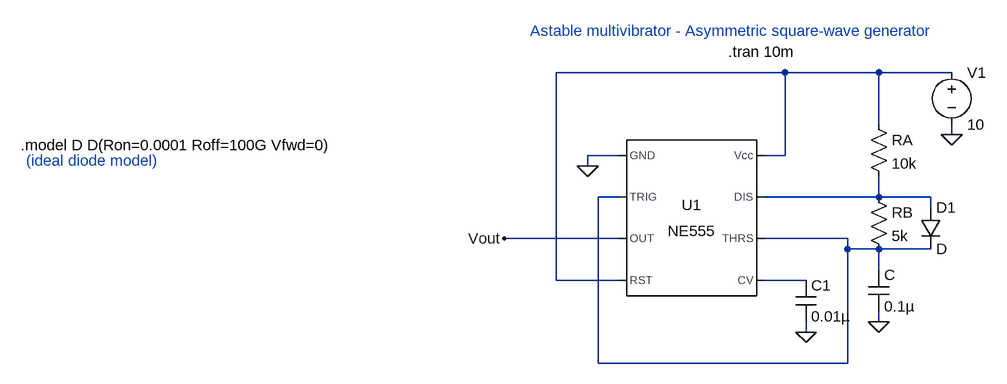
[diagram p0: schematic asymm-gen.asc]
asymm-gen.asc, the LTspice schematic file:
Version 4
SHEET 1 880 680
WIRE 368 -48 16 -48
WIRE 512 -48 368 -48
WIRE 624 -48 512 -48
WIRE 512 32 512 -48
WIRE 624 48 624 32
WIRE 112 80 64 80
WIRE 368 80 368 -48
WIRE 368 80 336 80
WIRE 64 96 64 80
WIRE 112 144 80 144
WIRE 512 144 512 112
WIRE 512 144 336 144
WIRE 592 144 512 144
WIRE 592 160 592 144
WIRE 112 208 -64 208
WIRE 464 208 336 208
WIRE 464 224 464 208
WIRE 512 224 464 224
WIRE 592 224 512 224
WIRE 512 256 512 224
WIRE 16 272 16 -48
WIRE 112 272 16 272
WIRE 400 272 336 272
WIRE 512 336 512 320
WIRE 400 352 400 336
WIRE 80 400 80 144
WIRE 464 400 464 224
WIRE 464 400 80 400
FLAG 64 96 0
FLAG 624 48 0
FLAG 400 352 0
FLAG 512 336 0
FLAG -64 208 Vout
SYMBOL Misc\\NE555 224 176 R0
SYMATTR InstName U1
SYMBOL voltage 624 -64 R0
WINDOW 123 0 0 Left 0
WINDOW 39 0 0 Left 0
SYMATTR InstName V1
SYMATTR Value 10
SYMBOL res 496 128 R0
SYMATTR InstName RB
SYMATTR Value 5k
SYMBOL res 496 16 R0
SYMATTR InstName RA
SYMATTR Value 10k
SYMBOL cap 384 272 R0
SYMATTR InstName C1
SYMATTR Value 0.01µ
SYMBOL cap 496 256 R0
SYMATTR InstName C
SYMATTR Value 0.1µ
SYMBOL diode 576 160 R0
SYMATTR InstName D1
TEXT 280 -80 Left 2 !.tran 10m
TEXT -24 -112 Left 2 ;Astable multivibrator - Asymmetric square-wave generator
TEXT -808 64 Left 2 !.model D D(Ron=0.0001 Roff=100G Vfwd=0)
TEXT -800 88 Left 2 ;(ideal diode model)

The netlist it stands for:
* asymm-gen.asc
XU1 0 N002 Vout N001 N004 N002 N003 N001 NE555  ; pins GND TRIG OUT RST CV THRS DIS Vcc
V1 N001 0 10
RB N003 N002 5k
RA N001 N003 10k
C1 N004 0 0.01µ
C N002 0 0.1µ
D1 N003 N002 D
.model D D
.lib standard.dio
.tran 10m
* Astable multivibrator - Asymmetric square-wave generator
.model D D(Ron=0.0001 Roff=100G Vfwd=0)
* (ideal diode model)
.lib NE555.sub
.backanno
.end